# EAGLE design NeoGeo-JAMMA-Supergun OD (EAGLE 9.6.2)
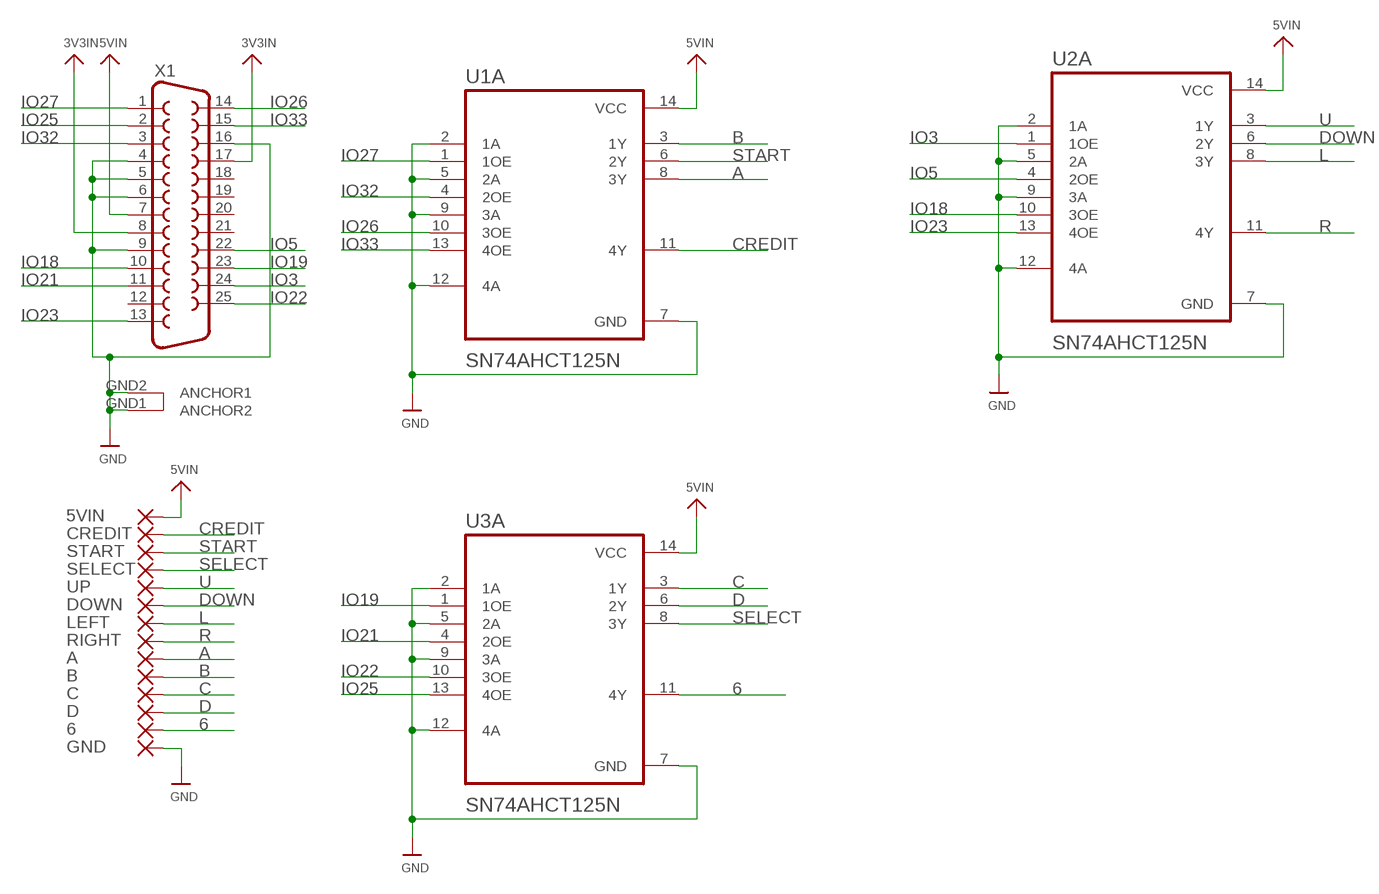
[diagram p0: schematic, sheet 1]

## Parts
5VIN  SMD5  [SMD2,54-5,08]
6  SMD5  [SMD2,54-5,08]
A  SMD5  [SMD2,54-5,08]
B  SMD5  [SMD2,54-5,08]
C  SMD5  [SMD2,54-5,08]
CREDIT  SMD5  [SMD2,54-5,08]
D  SMD5  [SMD2,54-5,08]
DOWN  SMD5  [SMD2,54-5,08]
GND  SMD5  [SMD2,54-5,08]
LEFT  SMD5  [SMD2,54-5,08]
RIGHT  SMD5  [SMD2,54-5,08]
SELECT  SMD5  [SMD2,54-5,08]
START  SMD5  [SMD2,54-5,08]
U1A  SN74AHCT125N  [DIP794W45P254L1969H508Q14]
U2A  SN74AHCT125N  [DIP794W45P254L1969H508Q14]
U3A  SN74AHCT125N  [DIP794W45P254L1969H508Q14]
UP  SMD5  [SMD2,54-5,08]
X1  DB25_FEMALEHP  [F25HP]

## Nets
3V3IN: X1.8 X1.17
5VIN: 5VIN.1(P) U1A.14(VCC) U2A.14(VCC) U3A.14(VCC) X1.7
6: 6.1(P) U3A.11(4Y)
A: A.1(P) U1A.8(3Y)
B: B.1(P) U1A.3(1Y)
C: C.1(P) U3A.3(1Y)
CREDIT: CREDIT.1(P) U1A.11(4Y)
D: D.1(P) U3A.6(2Y)
DOWN: DOWN.1(P) U2A.6(2Y)
GND: GND.1(P) U1A.2(1A) U1A.5(2A) U1A.7(GND) U1A.9(3A) U1A.12(4A) U2A.2(1A) U2A.5(2A) U2A.7(GND) U2A.9(3A) U2A.12(4A) U3A.2(1A) U3A.5(2A) U3A.7(GND) U3A.9(3A) U3A.12(4A) X1.4 X1.5 X1.6 X1.9 X1.16 X1.GND1(ANCHOR2) X1.GND2(ANCHOR1)
IO3: U2A.1(1OE) X1.24
IO5: U2A.4(2OE) X1.22
IO18: U2A.10(3OE) X1.10
IO19: U3A.1(1OE) X1.23
IO21: U3A.4(2OE) X1.11
IO22: U3A.10(3OE) X1.25
IO23: U2A.13(4OE) X1.13
IO25: U3A.13(4OE) X1.2
IO26: U1A.10(3OE) X1.14
IO27: U1A.1(1OE) X1.1
IO32: U1A.4(2OE) X1.3
IO33: U1A.13(4OE) X1.15
L: LEFT.1(P) U2A.8(3Y)
R: RIGHT.1(P) U2A.11(4Y)
SELECT: SELECT.1(P) U3A.8(3Y)
START: START.1(P) U1A.6(2Y)
U: U2A.3(1Y) UP.1(P)
Unconnected: X1.12 X1.18 X1.19 X1.20 X1.21

## Library data of the parts
5VIN 6 A B C CREDIT D DOWN GND LEFT RIGHT SELECT START UP = wirepad:SMD5: SMD PAD
U1A U2A U3A = SN74AHCT125N:SN74AHCT125N: None Check prices <https://pricing.snapeda.com/parts/SN74AHCT125N/Texas%20Instruments/view-part?ref=eda>; AVAILABILITY: In Stock; DESCRIPTION: Quadruple Bus Buffer Gates With 3-State Outputs 14-PDIP -40 to 125; MF: Texas Instruments; MP: SN74AHCT125N; PACKAGE: PDIP-14 Texas Instruments; PRICE: None; PURCHASE-URL: https://pricing.snapeda.com/search/part/SN74AHCT125N/?ref=eda
X1 = SparkFun-Retired:DB25_FEMALE: 25 Pin male connector. PCB edge mount for regular PCB thicknesses. This connector will connect directly to the back of a PC parallel port or through a normal DB25 extension cable (M/F). SKU: PRT-08287

## Board
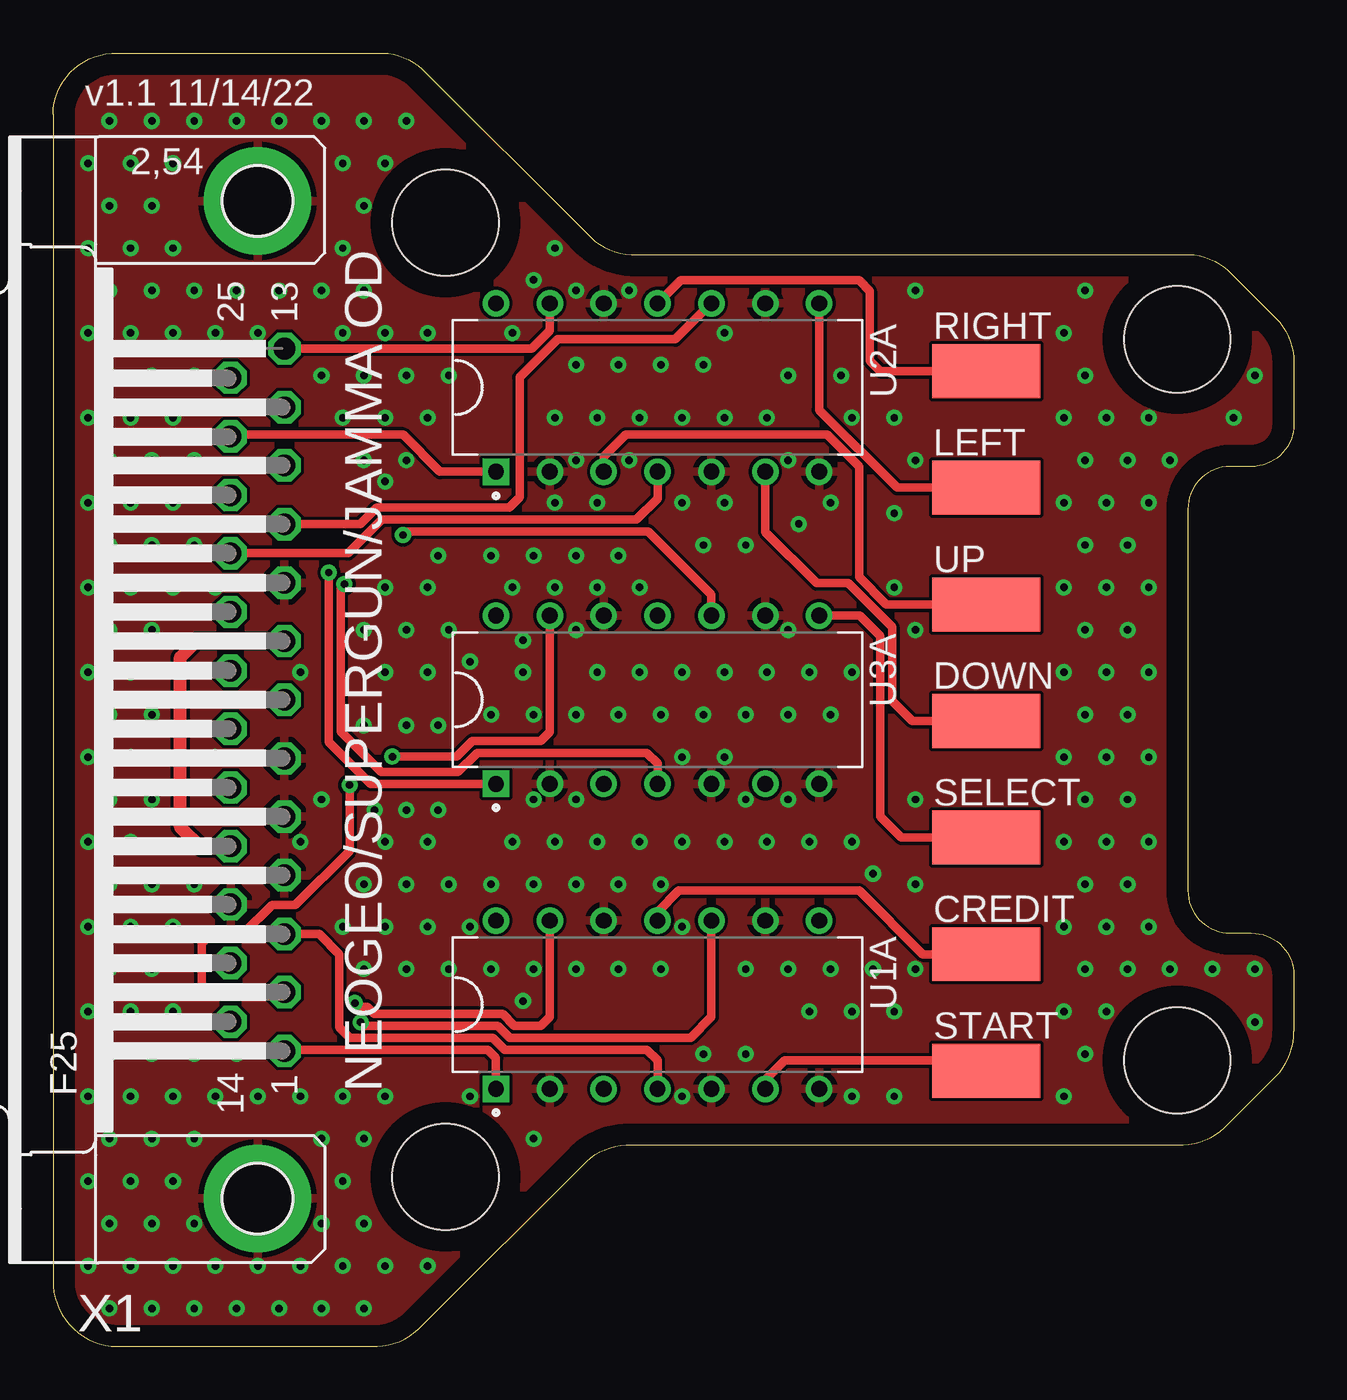
[diagram p1: board, top side]
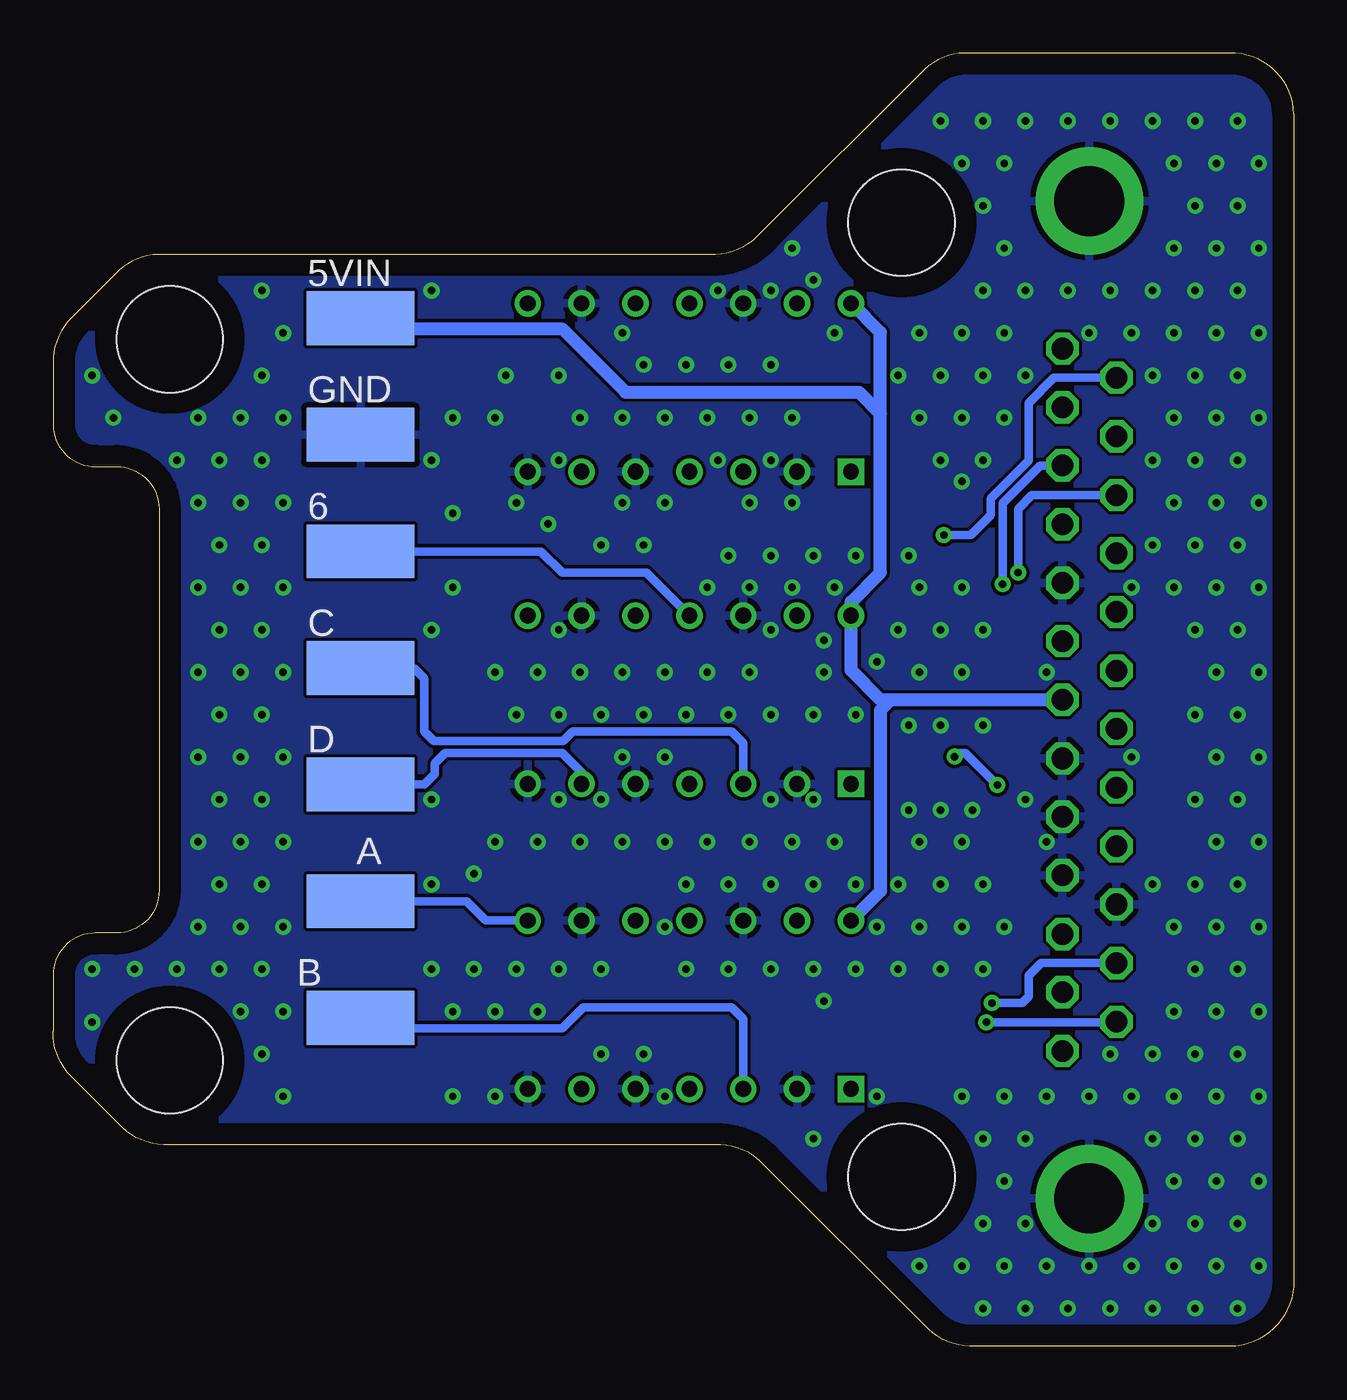
[diagram p2: board, bottom side, seen from below]

Size 58.5 x 61 mm. Coordinates in mm from the lower left corner, seen from the top.
Outline: 0,58.12 0,3.12 arc90 3.03,0 15.29,0 arc45 17.41,1 25.15,8.74 arc-45 27.27,9.5 53.29,9.5 arc45 55.41,10.5 57.65,12.74 arc45 58.5,14.86 58.5,17.5 arc90 56.5,19.5 55.5,19.5 arc-90 53.5,21.5 53.5,39.5 arc-90 55.5,41.5 56.5,41.5 arc90 58.5,43.5 58.5,46.38 arc45 57.65,48.5 55.41,50.74 arc45 53.29,51.5 27.27,51.5 arc-45 25.15,52.5 17.41,60.24 arc45 15.29,61 3.03,61 arc90 0,58.12
Copper layers (1*16): Top 0.035mm / dielectric 1.5mm / Bottom 0.035mm
Design rules "default": minimum track width 6mil, minimum drill 0.35mm, track to track 6mil, track to pad 6mil, pad to pad 6mil, via to via 6mil, smd to smd 6mil, copper to edge 40mil, drill to drill 6mil, minimum pad ring 10mil, minimum via ring 8mil, stop-mask expansion 4mil, vias tented up to drill 0.5mm, thermal gap 10mil
Holes 5 mm at 53,13.5 53,47.5 18.5,53 18.5,8

### Footprints (pad centres in the part's own frame; a part is rotated, then mirrored left to right if it is on the bottom)
SMD2,54-5,08 = smd 2.54 x 5.08: 1 0,0
DIP794W45P254L1969H508Q14 = drill 0.74 pad 1.14 square: 1 -3.97,7.62 | drill 0.74 pad 1.14: 2 -3.97,5.08; 3 -3.97,2.54; 4 -3.97,0; 5 -3.97,-2.54; 6 -3.97,-5.08; 7 -3.97,-7.62; 8 3.97,-7.62; 9 3.97,-5.08; 10 3.97,-2.54; 11 3.97,0; 12 3.97,2.54; 13 3.97,5.08; 14 3.97,7.62
F25HP = drill 1.016 octagon: 1 -16.561,-1.27; 2 -13.792,-1.27; 3 -11.049,-1.27; 4 -8.28,-1.27; 5 -5.512,-1.27; 6 -2.769,-1.27; 7 0,-1.27; 8 2.769,-1.27; 9 5.512,-1.27; 10 8.28,-1.27; 11 11.049,-1.27; 12 13.792,-1.27; 13 16.561,-1.27; 14 -15.189,1.27; 15 -12.421,1.27; 16 -9.652,1.27; 17 -6.909,1.27; 18 -4.14,1.27; 19 -1.372,1.27; 20 1.372,1.27; 21 4.14,1.27; 22 6.909,1.27; 23 9.652,1.27; 24 12.421,1.27; 25 15.189,1.27 | drill 3.302 pad 5.08: GND1 -23.52,0; GND2 23.52,0

### Placement (x,y rotation side)
5VIN  44,48.5 270 bottom
6  44,37.5 270 bottom
A  44,21 270 bottom
B  44,15.5 270 bottom
C  44,32 270 bottom
CREDIT  44,18.5 270 top
D  44,26.5 270 bottom
DOWN  44,29.5 270 top
GND  44,43 270 bottom
LEFT  44,40.5 270 top
RIGHT  44,46 270 top
SELECT  44,24 270 top
START  44,13 270 top
U1A  28.5,16.12 90 top
U2A  28.5,45.23 90 top
U3A  28.5,30.5 90 top
UP  44,35 270 top
X1  9.64,30.5 90 top

### Tracks (layer width: path | path; a pad name or v marks a point on that pad's centre or on a via)
3V3IN
  Top 0.61: X1.17 8.28,23.5 7,23.5 6,24.5 6,32.5 6.77,33.27 X1.8
5VIN
  Bottom 0.61: X1.7 19,30.5 | 19,30.5 19.5,30.5 20.88,31.88 U3A.14 20.88,35.12 19.5,36.5 19.5,44 | U2A.14 19.5,47.82 19.5,44 | 19,30.5 19.5,30 19.5,21.47 U1A.14 | 5VIN.1 43.5,48 34.5,48 31.5,45 20.5,45 19.5,44
6
  Bottom 0.406: U3A.11 30.53,36.5 34.5,36.5 35.5,37.5 6.1
A
  Bottom 0.406: U1A.8 38.09,20.09 39,21 A.1
B
  Bottom 0.406: U1A.3 25.96,15.46 26.5,16 33.5,16 34.5,15 43.5,15 B.1
C
  Bottom 0.406: U3A.3 25.96,28.46 26.5,29 34,29 34.44,28.56 40.56,28.56 41,29 41,31.5 41.5,32 C.1
CREDIT
  Top 0.406: U1A.11 28.5,20.5 29.5,21.5 38,21.5 41,18.5 CREDIT.1
D
  Bottom 0.406: U3A.6 33.58,27.08 34.5,28 40,28 40.5,27.5 40.5,27 41,26.5 D.1
DOWN
  Top 0.406: U2A.6 33.58,38.42 36,36 37.5,36 39.56,33.94 39.56,30.44 40.5,29.5 DOWN.1
GND  (via drill 0.35)
  other vias: 2.66,1.8 1.66,3.8 2.66,5.8 1.66,7.8 2.66,9.8 1.66,11.8 2.66,13.8 1.66,15.8 2.66,17.8 1.66,19.8 2.66,21.8 1.66,23.8 2.66,25.8 1.66,27.8 2.66,29.8 1.66,31.8 2.66,33.8 1.66,35.8 2.66,37.8 1.66,39.8 2.66,41.8 1.66,43.8 2.66,45.8 1.66,47.8 2.66,49.8 1.66,51.8 2.66,53.8 1.66,55.8 2.66,57.8 4.66,1.8 3.66,3.8 4.66,5.8 3.66,7.8 4.66,9.8 3.66,11.8 4.66,13.8 3.66,15.8 4.66,17.8 3.66,19.8 4.66,21.8 3.66,23.8 4.66,25.8 3.66,27.8 4.66,29.8 3.66,31.8 4.66,33.8 3.66,35.8 4.66,37.8 3.66,39.8 4.66,41.8 3.66,43.8 4.66,45.8 3.66,47.8 4.66,49.8 3.66,51.8 4.66,53.8 3.66,55.8 4.66,57.8 6.66,1.8 5.66,3.8 6.66,5.8 5.66,7.8 6.66,9.8 5.66,11.8 6.66,13.8 5.66,15.8 5.66,19.8 6.66,21.8 5.66,35.8 6.66,37.8 5.66,39.8 6.66,41.8 5.66,43.8 6.66,45.8 5.66,47.8 6.66,49.8 5.66,51.8 5.66,55.8 6.66,57.8 8.66,1.8 7.66,3.8 7.66,11.8 8.66,13.8 7.66,27.8 7.66,35.8 7.66,47.8 8.66,49.8 8.66,57.8 10.66,1.8 9.66,3.8 9.66,11.8 9.66,47.8 10.66,49.8 10.66,57.8 12.66,1.8 11.66,3.8 12.66,5.8 12.66,9.8 11.66,11.8 11.66,23.8 12.66,25.8 11.66,31.8 12.66,45.8 12.66,49.8 12.66,57.8 14.66,1.8 13.66,3.8 14.66,5.8 13.66,7.8 14.66,9.8 13.66,11.8 14.66,17.8 13.66,19.8 14.66,21.8 15.16,25.3 14.66,29.3 14.66,33.8 14.66,41.8 13.66,43.8 14.66,45.8 13.66,47.8 14.66,49.8 13.66,51.8 14.66,53.8 13.66,55.8 14.66,57.8 15.66,3.8 15.66,11.8 16.66,17.8 15.66,19.8 16.66,21.8 15.66,23.8 16.66,25.3 16.66,29.3 15.66,31.8 16.66,33.8 15.66,35.8 16.66,41.8 15.66,43.8 16.66,45.8 15.66,47.8 15.66,55.8 16.66,57.8 17.66,3.8 18.66,17.8 17.66,19.8 18.66,21.8 17.66,23.8 18.16,25.3 18.16,29.3 17.66,31.8 18.66,33.8 17.66,35.8 18.16,37.3 15.66,40.8 17.66,43.8 18.66,45.8 17.66,47.8 19.66,11.8 20.66,17.8 19.66,19.8 20.66,21.8 20.66,29.8 19.66,32.3 20.66,37.3 22.66,9.8 22.16,16.3 22.66,17.8 22.66,21.8 21.66,23.8 22.66,25.8 22.66,29.8 22.16,31.8 22.16,33.3 21.66,35.8 22.66,37.3 21.66,47.8 22.66,50.3 24.66,17.8 24.66,21.8 23.66,23.8 24.66,25.8 24.66,29.8 24.66,33.8 23.66,35.8 24.66,37.3 23.66,39.8 24.66,41.8 23.66,43.8 24.66,46.3 24.66,49.8 23.66,51.8 26.66,17.8 26.66,21.8 25.66,23.8 26.66,29.8 25.66,31.8 25.66,35.8 26.66,37.3 25.66,39.8 27.16,41.8 25.66,43.8 26.66,46.3 27.16,49.8 28.66,17.8 28.66,21.8 27.66,23.8 28.66,29.8 27.66,31.8 27.66,35.8 27.66,43.8 28.66,46.3 29.66,11.8 30.66,13.8 29.66,19.8 29.66,23.8 29.66,27.8 30.66,29.8 29.66,31.8 30.66,37.8 29.66,39.8 29.66,43.8 30.66,46.3 32.66,13.8 32.66,17.8 31.66,23.8 32.66,25.8 31.66,27.8 32.66,29.8 31.66,31.8 32.66,37.8 31.66,39.8 35.16,38.8 31.66,43.8 31.66,47.8 34.66,17.8 33.66,23.8 34.66,25.8 34.66,29.8 33.66,31.8 34.66,33.8 34.66,41.8 33.66,43.8 34.66,45.8 35.66,15.8 36.66,17.8 35.66,23.8 36.66,29.8 35.66,31.8 36.66,39.8 37.16,45.8 37.66,11.8 37.66,15.8 38.66,17.8 38.66,22.3 37.66,23.8 37.66,31.8 37.66,43.8 39.66,11.8 39.66,15.8 40.66,17.8 40.66,21.8 40.66,25.8 40.66,33.8 39.66,35.8 39.66,39.3 40.66,41.8 39.66,43.8 40.66,49.8 47.66,11.8 48.66,13.8 47.66,15.8 48.66,17.8 47.66,19.8 48.66,21.8 47.66,23.8 48.66,25.8 47.66,27.8 48.66,29.8 47.66,31.8 48.66,33.8 47.66,35.8 48.66,37.8 47.66,39.8 48.66,41.8 47.66,43.8 48.66,45.8 47.66,47.8 48.66,49.8 49.66,15.8 50.66,17.8 49.66,19.8 50.66,21.8 49.66,23.8 50.66,25.8 49.66,27.8 50.66,29.8 49.66,31.8 50.66,33.8 49.66,35.8 50.66,37.8 49.66,39.8 50.66,41.8 49.66,43.8 52.66,17.8 51.66,19.8 51.66,23.8 51.66,27.8 51.66,31.8 51.66,35.8 51.66,39.8 52.66,41.8 51.66,43.8 54.66,17.8 56.66,15.3 56.66,17.8 55.66,43.8 56.66,45.8
  pour Bottom: 0,0 0,61.12 28.53,61.12 28.53,51.62 59.03,51.62 59.03,9.5 28.03,9.5 28.03,0
  pour Top: 0,0 0,61.12 28.53,61.12 28.53,51.62 59.03,51.62 59.03,9.5 28.03,9.5 28.03,0
IO3
  Top 0.406: U2A.1 18.24,41.26 16.5,43 8.45,43 X1.24
IO5
  Top 0.406: X1.22 13.91,37.41 15.5,39 27.5,39 28.5,40 U2A.4
IO18
  Top 0.406: U2A.10 29.34,47.5 23.79,47.5 22,45.71 22,40.06 21.5,39.56 15.27,39.56 14.49,38.78 X1.10
IO19  (via drill 0.35)
  Top 0.406: U3A.1 14.97,26.53 13,28.5 v13,36.5
  Bottom 0.406: v13,36.5 13,39.5 12.35,40.15 X1.23
IO21  (via drill 0.35)
  Top 0.406: U3A.4 28.5,27.5 28,28 20,28 19.09,27.09 15.47,27.09 13.56,29 13.56,35.77 v13.73,35.95
  Bottom 0.406: v13.73,35.95 13.73,39.77 11.95,41.55 X1.11
IO22  (via drill 0.35)
  Top 0.406: U3A.10 31.04,35.46 28.06,38.44 16.68,38.44 v16.5,38.27
  Bottom 0.406: v16.5,38.27 15.23,38.27 14.29,39.21 14.29,40 12.5,41.79 12.5,44.5 11.31,45.69 X1.25
IO23
  Top 0.406: U2A.13 23.42,47.92 22.56,47.06 X1.13
IO25  (via drill 0.35)
  Top 0.406: U3A.13 23.42,28.98 23,28.56 19.77,28.56 19.03,27.82 v16,27.82 | X1.2 7.29,16.71 7,17 7,19 7.5,19.5 9,19.5 10.33,20.83 11.43,20.83 13.98,23.38 v13.98,26.48
  Bottom 0.406: v16,27.82 15.82,28 15.5,28 v13.98,26.48
IO26  (via drill 0.35)
  Top 0.406: U1A.10 31.04,15.54 30.06,14.56 21.52,14.56 20.96,15.12 14.68,15.12 v14.5,15.29
  Bottom 0.406: v14.5,15.29 8.39,15.29 X1.14
IO27
  Top 0.406: U1A.1 20.88,13.62 20.5,14 10.97,14 X1.1
IO32
  Top 0.406: U1A.4 28.5,13.5 28,14 21.29,14 20.73,14.56 14,14.56 13.5,15.06 13.5,18.5 12.55,19.45 X1.3
IO33  (via drill 0.35)
  Top 0.406: U1A.13 23.42,15.54 23,15.12 21.75,15.12 21.19,15.68 15.15,15.68 14.8,16.03 14.41,16.03 v14.23,16.2
  Bottom 0.406: v14.23,16.2 12.8,16.2 12.5,16.5 12.5,17.5 11.92,18.08 X1.15
L
  Top 0.406: U2A.8 36.12,44.17 39.79,40.5 LEFT.1
R
  Top 0.406: U2A.11 29.58,50.28 38,50.28 38.5,49.78 38.5,46.5 39,46 RIGHT.1
SELECT
  Top 0.406: U3A.8 38.03,34.47 39,33.5 39,25 40,24 SELECT.1
START
  Top 0.406: U1A.6 33.58,12.58 34.5,13.5 43.5,13.5 START.1
U
  Top 0.406: U2A.3 25.96,41.96 27,43 36.5,43 38,41.5 38,36.29 39.29,35 UP.1

### Text on the board
tPlace: v1.1 11/14/22 | NEOGEO/SUPERGUN/JAMMA OD